# EasyEDA Pro project esp8266开关.eprj, board 2.0
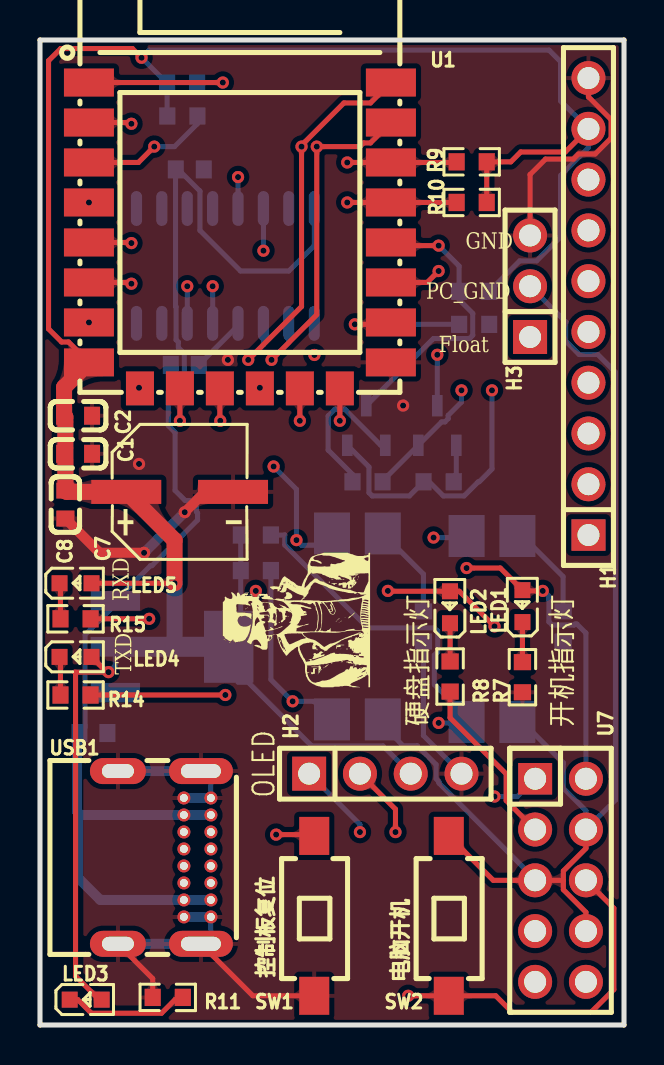
[diagram p2: board, top side]
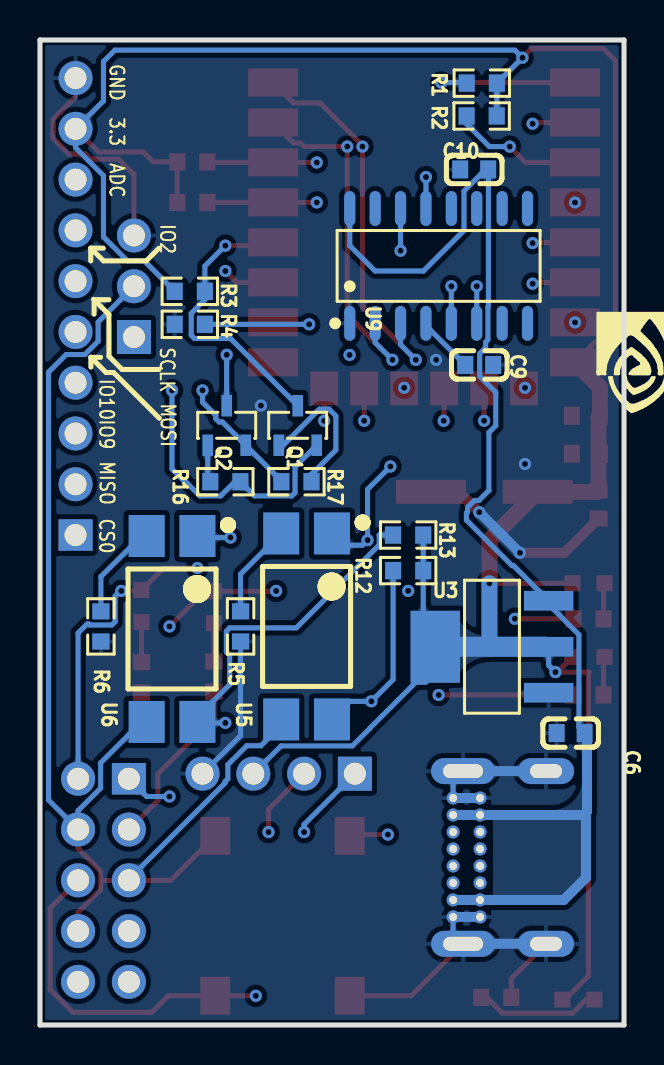
[diagram p3: board, bottom side, seen from below]

Outline 29.21 x 49.28 mm; copper layers: Top Layer, Inner1, Inner2, Bottom Layer. Coordinates in mm from the lower left corner of the outline.
Outline path: 0,49.28 29.21,49.28 29.21,0 0,0 0,49.28
Stack: Top Layer 0.035mm 外层铜厚1oz / Dielectric1 0.2104mm 7628 RC49% 8.6mil / Inner1 0.0152mm 内层铜厚 / Dielectric2 1.065mm 1.1mm H/HOZ Copper / Inner2 0.0152mm 内层铜厚 / Dielectric3 0.2104mm 7628 RC49% 8.6mil / Bottom Layer 0.035mm 外层铜厚1oz

## Design rules (mm)
template: JLCPCB Capability(Two Layers Board)
spacing copperThickness1oz (default): track to track 0.102, other pairs 0.152 to 0.3
spacing copperThickness2oz: track to track 0.203, other pairs 0.152 to 0.3
track width copperThickness1oz (default): min 0.127, default 0.254, max 2.54
track width copperThickness2oz: min 0.203, default 0.254, max 2.54
differential pair differentialPair (default): width min 0.127, default 0.254, max 2.54; gap min 0.152, default 0.152
via viaSize (default): diameter min 0.5, default 0.61, max 10; hole min 0.3, default 0.305, max 6.3

## Placement (name value [footprint] x y rotation side)
C1  100nF  [C0603]  1.91 28.58 180 top
C2  10uF  [C0603]  1.91 30.48 180 top
C6  100nF  [C0603]  2.67 14.61 180 bottom
C7  220uF  [CAP-SMD_BD6.3-L6.6-W6.6-FD]  6.99 26.67 0 top
C8  100nF  [C0603]  1.27 26.03 90 top
C9  100nF  [C0603]  7.24 33.02 0 bottom
C10  100nF  [C0603]  7.49 42.8 180 bottom
H1  其他  [HDR-TH_10P-P2.54-V-F]  27.43 35.94 90 top
H2  OLED  [HDR-TH_4P-P2.54-V-F]  17.27 12.57 0 top
H3  PZ254V-11-03P  [HDR-TH_3P-P2.54-V-M]  24.51 36.96 90 top
LED1  MHT192WDT-ICE  [LED0603-RD]  24.13 20.95 90 top
LED2  MHT192WDT-ICE  [LED0603-RD]  20.51 20.9 90 top
LED3  MHT192WDT-ICE  [LED0603-RD]  2.29 1.27 0 top
LED4  MHT192WDT-ICE  [LED0603-RD]  1.78 18.42 0 top
LED5  MHT192WDT-ICE  [LED0603-RD]  1.78 22.1 0 top
Q1  S8050  [SOT-23-3_L2.9-W1.3-P1.90-LS2.3-BR]  16.32 29.99 270 bottom
Q2  S8050  [SOT-23-3_L2.9-W1.3-P1.90-LS2.3-BR]  19.87 29.99 270 bottom
R1  10kΩ  [R0603]  7.11 47.12 0 bottom
R2  10kΩ  [R0603]  7.12 45.47 0 bottom
R3  10kΩ  [R0603]  21.72 36.7 0 bottom
R4  10kΩ  [R0603]  21.72 35.05 0 bottom
R5  50Ω  [R0603]  19.18 19.94 90 bottom
R6  50Ω  [R0603]  26.16 19.94 90 bottom
R7  550Ω  [R0603]  24.13 17.4 90 top
R8  550Ω  [R0603]  20.51 17.43 90 top
R9  4.7kΩ  [R0603]  21.59 43.18 0 top
R10  4.7kΩ  [R0603]  21.59 41.15 0 top
R11  550Ω  [R0603]  6.39 1.38 0 top
R12  10kΩ  [R0603]  10.79 22.73 180 bottom
R13  10kΩ  [R0603]  10.79 24.51 180 bottom
R14  550Ω  [R0603]  1.78 16.51 180 top
R15  550Ω  [R0603]  1.78 20.32 180 top
R16  10kΩ  [R0603]  19.94 27.18 0 bottom
R17  10kΩ  [R0603]  16.38 27.18 180 bottom
SW1  TS-1101-C-W  [SW-SMD_L6.0-W3.3-LS8.0]  13.72 5.46 90 top
SW2  TS-1101-C-W  [SW-SMD_L6.0-W3.3-LS8.0]  20.45 5.46 90 top
U1  2.4GHz  [WIFIM-SMD_ESP-12F-ESP8266MOD]  10 39.5 270 top
U3  AMS1117-3.3  [SOT-223-4_L6.5-W3.5-P2.30-LS7.0-BR]  6.6 18.92 180 bottom
U5  PS2501-S  [SMD-4_L5.5-W4.5-P2.54-LS10.0-TL]  15.88 19.94 270 bottom
U6  PS2501-S  [SMD-4_L5.5-W4.5-P2.54-LS10.0-TL]  22.61 19.81 270 bottom
U7  PM254-2-05-Z-8.5  [HDR-TH_10P-P2.54-V-F-R2-C5-S2.54]  26.03 7.24 270 top
U9  CH340C  [SOP-16_L10.0-W3.9-P1.27-LS6.0-BL]  9.27 37.97 180 bottom
USB1  TYPEC-306DDW-ARP16  [USB-C-TH_TYPEC-306DDW-ARP16]  6.22 8.38 270 top

## Footprints (pads in the part's own frame, mm; a bottom-side part is the same pattern mirrored in y, then rotated)
C0603
  rect 0.8x0.9 smd: 1(-0.7,0) 2(0.7,0)
CAP-SMD_BD6.3-L6.6-W6.6-FD
  rect 3.5x1.2 smd: 1(-2.67,0) 2(2.67,0)
HDR-TH_3P-P2.54-V-M
  rect 1.7x1.7 hole 1.1: 1(-2.54,0)
  round 1.7 hole 1.1: 2(0,0) 3(2.54,0)
HDR-TH_4P-P2.54-V-F
  rect 1.7x1.7 hole 1.1: 1(-3.81,0)
  round 1.7 hole 1.1: 2(-1.27,0) 3(1.27,0) 4(3.81,0)
HDR-TH_10P-P2.54-V-F
  rect 1.575x1.7 hole 1.1: 1(-11.43,0)
  round 1.7 hole 1.1: 2(-8.89,0) 3(-6.35,0) 4(-3.81,0) 5(-1.27,0) 6(1.27,0) 7(3.81,0) 8(6.35,0) 9(8.89,0) 10(11.43,0)
HDR-TH_10P-P2.54-V-F-R2-C5-S2.54
  rect 1.575x1.7 hole 1.1: 1(-5.08,-1.27)
  round 1.7 hole 1.1: 2(-5.08,1.27) 3(-2.54,-1.27) 4(-2.54,1.27) 5(0,-1.27) 6(0,1.27) 7(2.54,-1.27) 8(2.54,1.27) 9(5.08,-1.27) 10(5.08,1.27)
LED0603-RD
  rect 0.8x0.8 smd: 1(-0.799,0) 2(0.799,0)
R0603
  rect 0.806x0.864 smd: 1(-0.753,0) 2(0.753,0)
SMD-4_L5.5-W4.5-P2.54-LS10.0-TL
  rect 2.1x1.8 smd: 1(-4.65,1.27) 2(-4.65,-1.27) 3(4.65,-1.27) 4(4.65,1.27)
SOP-16_L10.0-W3.9-P1.27-LS6.0-BL
  oval 0.56x1.745 smd: 1(-4.445,-2.873) 2(-3.175,-2.873) 3(-1.905,-2.873) 4(-0.635,-2.873) 5(0.635,-2.873) 6(1.905,-2.873) 7(3.175,-2.873) 8(4.445,-2.873) 9(4.445,2.873) 10(3.175,2.873) 11(1.905,2.873) 12(0.635,2.873) 13(-0.635,2.873) 14(-1.905,2.873) 15(-3.175,2.873) 16(-4.445,2.873)
SOT-23-3_L2.9-W1.3-P1.90-LS2.3-BR
  rect 1.07x0.532 smd: 1(0.99,-0.95) 2(0.99,0.95) 3(-0.99,0)
SOT-223-4_L6.5-W3.5-P2.30-LS7.0-BR
  rect 2.47x0.98 smd: 1(2.835,-2.3) 2(2.835,0) 3(2.835,2.3)
  rect 2.47x3.6 smd: 4(-2.835,0)
SW-SMD_L6.0-W3.3-LS8.0
  rect 1.9x1.5 smd: 1(-4,0) 2(4,0)
USB-C-TH_TYPEC-306DDW-ARP16
  oval 1.3x3.2 hole 0.7x2: 17(4.32,1.825) 20(-4.32,1.825)
  oval 1.3x2.8 hole 0.7x1.6: 18(4.32,-2.325) 19(-4.32,-2.325)
  round 0.65 hole 0.4: A1(-2.975,2.325) A4(-2.125,2.325) A5(-1.275,2.325) A6(-0.425,2.325) A7(0.425,2.325) A8(1.275,2.325) A9(2.125,2.325) A12(2.975,2.325) B1(2.975,0.975) B4(2.125,0.975) B5(1.275,0.975) B6(0.425,0.975) B7(-0.425,0.975) B8(-1.275,0.975) B9(-2.125,0.975) B12(-2.975,0.975)
WIFIM-SMD_ESP-12F-ESP8266MOD
  rect 1.4x2.5 smd: 1(-7.651,-7.551) 2(-5.651,-7.551) 3(-3.651,-7.551) 4(-1.651,-7.551) 5(0.349,-7.551) 6(2.349,-7.551) 7(4.349,-7.551) 8(6.349,-7.551) 9(6.349,7.548) 10(4.349,7.55) 11(2.349,7.551) 12(0.349,7.551) 13(-1.651,7.55) 14(-3.651,7.551) 15(-5.651,7.551) 16(-7.651,7.551)
  rect 1.7x1.4 smd: 17(7.651,-5) 18(7.649,-3.002) 19(7.649,-1.004) 20(7.649,0.998) 21(7.649,2.997) 22(7.651,4.997)

## Nets
As in the schematic.

Pads without a net: H3 1; U7 9 10; U9 7 8 9 10 11 12 15; USB1 A5 A8 B5 B8

## Via types
v1: diameter 0.61, hole 0.305, Top Layer to Bottom Layer, 55 vias

## Routing (per net, layer and track width the routed paths; a pad name or vN(x,y) marks a point on that pad's centre or on a via; arc(x,y) is an arc through that point)
+3.3V: length 134.6
  Top Layer w0.254: 3.34,17.65 1.74,17.65 1.78,17.62 1.78,2.45 3.09,1.14 ; 3.34,17.65 v1(3.43,17.65) ; 3.34,17.65 LED4.2 ; H1.9 26.28,43.67 24.04,43.67 23.55,43.18 R9.2 R10.2 ; v1(5.08,48.39) 4.62,48.85 1.04,48.85 0.43,48.24 0.43,34.82 1.08,34.17 1.43,34.17 U1.8 ; LED5.2 v1(6.73,22.1)
  Top Layer w0.8: v1(6.73,22.1) 6.73,24.25 C7.1 1.34,26.67 C8.2 1.27,30.42 C2.2 1.21,31.9 U1.8
  Bottom Layer w0.254: R2.1 6.36,45.48 R1.1 6.35,47.12 v1(5.08,48.39) 5.46,48.77 25.46,48.77 26.03,48.2 26.03,46.23 H1.9 27.43,43.89 26.03,42.49 26.03,39.42 24.84,38.23 23.99,38.23 R3.2 ; 9.91,17.14 10.41,17.14 12.7,14.86 12.7,14.85 13.59,13.96 17.16,13.96 H2.3 ; v1(3.43,17.65) 3.77,17.99 U3.2 ; R13.2 R12.2 10.04,19.53 U3.4
  Bottom Layer w0.8: v1(6.73,22.1) 6.73,18.99 6.67,18.92
  Bottom Layer w1: U3.4 3.9,18.92
GND: length 54.1
  Top Layer w0.254: USB1.17 10.65,1.46 SW1.1 ; 18.16,33.15 U1.9 ; 5.64,1.13 5.64,2.32 USB1.18 ; H3.3 24.51,42.55 25.28,43.32 26.68,43.32 26.94,43.57 27.77,43.57 28.56,44.36 28.56,45.3 27.43,46.43 H1.10
  Top Layer w0.5: v1(5.21,23.62) 2.98,23.62 C8.1 ; v1(7.24,25.65) 8.25,26.67 C7.2
  Bottom Layer w0.254: USB1.A12 8.55,4.56 USB1.17 ; USB1.20 8.55,12.2 USB1.A1 ; R5.1 19.18,14.48 H2.4
  Bottom Layer w0.5: USB1.19 USB1.20 ; v1(5.21,23.62) v1(7.24,25.65) ; USB1.17 USB1.18 ; USB1.B12 USB1.A1 ; USB1.A12 7.32,5.41
  vias: v1(4.95,28.07) v1(9.4,33.27) v1(18.16,30.99)
VCC: length 65.6
  Bottom Layer w0.254: U9.16 13.72,38.99 12.45,37.72 10.03,37.72 8,39.75 8,41.72 6.78,42.94 6.78,35.95 6.81,35.92 6.81,34.28 6.92,34.16 6.92,33.88 7.22,33.59 7.22,32.45 6.41,31.65 6.41,29.98 6.76,29.64 6.76,26.74 7.26,26.24 7.48,26.24 7.82,25.9 7.82,25.67 7.88,25.61 7.88,25.26 5.6,22.98 5.53,22.98 U3.3 3.77,21.04 2.25,19.53 2.25,14.89 C6.2
  Bottom Layer w0.5: 1.91,10.51 1.91,7.37 3.01,6.26 7.07,6.26 ; USB1.A4 USB1.B9 2.03,10.51 1.85,10.69 1.85,14.49 C6.2 ; USB1.A9 USB1.B4
ADC: length 26.2
  Top Layer w0.254: U1.2 4.51,45.15 v1(4.57,45.08)
  Inner1 w0.254: H1.8 26.03,43.69 23.75,43.69 22.91,44.53 5.13,44.53 v1(4.57,45.08)
CS0: length 26.5
  Inner1 w0.254: v1(4.95,31.88) 4.95,30.3 8.05,27.2 23.6,27.2 26.29,24.51 H1.1
D+: length 33.1
  Inner2 w0.254: 7.2,7.96 7.7,7.96 7.94,8.2 7.94,8.21 8.3,8.56 8.3,8.56 USB1.A6 8.79,9.05 8.8,9.05 10.03,10.29 10.03,13.33 8.43,14.94 8.43,30.47 8.64,30.67 v1(8.64,36.96)
  Bottom Layer w0.254: U9.5 v1(8.64,36.96)
D-: length 33.1
  Inner1 w0.254: USB1.B7 7.7,8.81 7.94,8.56 7.94,8.56 8.3,8.2 8.3,8.2 8.55,7.96
  Inner2 w0.254: USB1.B7 6.95,9.05 6.95,9.05 6.17,9.83 6.17,15.06 7.87,16.76 7.87,30.3 7.49,30.68 7.49,36.83 v1(7.37,36.96)
  Bottom Layer w0.254: U9.6 v1(7.37,36.96)
DTR: length 32.8
  Inner1 w0.254: v1(22.61,31.75) 21.41,32.94 19.63,32.94 10.16,42.42 v1(9.91,42.42)
  Bottom Layer w0.254: v1(9.91,42.42) U9.13 ; Q1.2 16.45,27.92 16.45,26.63 16.62,26.47 18.47,26.47 R16.1 19.46,27.18 20.17,26.47 21.21,26.47 21.92,27.18 21.97,27.18 22.61,27.81 v1(22.61,31.75)
EN: length 27.6
  Top Layer w0.254: U1.3 4.92,43.15 v1(5.72,43.94)
  Inner1 w0.254: v1(5.72,43.94) 9.46,43.94 v1(19.87,33.53)
  Bottom Layer w0.254: Q2.3 v1(19.87,33.53) ; v1(5.72,43.94) 6.73,43.94 7.87,45.08 R2.2
ESP_RST: length 49
  Top Layer w0.254: U1.1 v1(9.14,47.15) ; SW1.2 13.65,9.53 v1(11.81,9.53)
  Inner2 w0.254: v1(11.81,9.53) 11.81,27.24 12.27,27.7 12.27,44.02 v1(9.14,47.15)
  Bottom Layer w0.254: R1.2 7.9,47.15 v1(9.14,47.15)
ESP_RXD: length 38.7
  Top Layer w0.254: U1.15 16.53,44.13 16.19,44.13 16,43.94 v1(13.84,43.94) 13.84,35.54 v1(11.58,33.27) ; R15.1 v1(5.46,20.32)
  Inner1 w0.254: v1(5.46,20.32) 9.4,20.32 v1(10.79,21.72)
  Inner2 w0.254: v1(10.79,21.72) 11.1,22.02 11.1,28.18 11.58,28.66 v1(11.58,33.27)
  Bottom Layer w0.254: v1(11.58,33.27) 12.45,34.14 U9.2
ESP_TXD: length 43.7
  Top Layer w0.254: v1(10.41,33.27) 13.08,35.94 v1(13.08,43.94) 13.08,44.01 15.2,46.13 16.53,46.13 U1.16 ; v1(9.27,16.51) R14.1
  Inner2 w0.254: v1(10.41,33.27) 10.21,33.07 10.21,17.45 v1(9.27,16.51)
  Bottom Layer w0.254: v1(10.41,33.27) 11.18,34.04 U9.3
HDD_LED+: length 45.3
  Top Layer w0.254: v1(22.73,19.94) 20.97,21.7 LED2.2 17.42,21.7 v1(17.4,21.72) ; U1.5 4.54,39.15 v1(4.57,39.12)
  Inner1 w0.254: v1(4.57,39.12) 4.57,37.91 3.99,37.33 3.99,29.99 10.74,23.24 10.79,23.24 12.32,21.72 v1(17.4,21.72) ; v1(22.73,11.43) v1(22.73,19.94)
  Bottom Layer w0.254: U7.1 23.88,11.43 v1(22.73,11.43)
HDD_LED-: length 8.7
  Top Layer w0.254: R8.1 20.51,15.37 23.32,12.56 23.32,11.23 U7.3
IO0: length 14.4
  Top Layer w0.254: v1(19.94,38.99) 17.71,38.99 U1.12
  Bottom Layer w0.254: v1(19.94,38.99) 20.96,37.96 R3.1 20.96,36.28 21.65,35.6 21.65,34.5 21.48,34.34 19.68,34.34 Q1.3
IO2: length 11
  Top Layer w0.254: v1(19.94,37.72) 19.37,37.15 U1.11
  Inner1 w0.254: H1.7 26.54,39.75 24.88,38.09 24.04,38.09 23.68,37.72 v1(19.94,37.72)
IO9: length 21.4
  Top Layer w0.254: U1.19 9,30.25 v1(9.02,30.23)
  Inner1 w0.254: H1.3 26.8,30.23 26.03,30.23 24.73,28.93 11.47,28.93 10.17,30.23 v1(9.02,30.23)
IO10: length 19
  Inner1 w0.254: H1.4 25.53,30.23 23.49,30.23 22.55,29.29 13.11,29.29 11,31.4 v1(11,31.88)
MISO: length 26.3
  Top Layer w0.254: U1.18 v1(7,30.23)
  Inner1 w0.254: v1(7,30.23) 8.19,30.23 9.84,28.57 16.09,28.57 16.27,28.39 16.27,27.81 16.45,27.63 17.62,27.63 17.79,27.81 17.79,28.39 17.97,28.57 19.14,28.57 19.32,28.39 19.32,27.81 19.5,27.63 20.66,27.63 20.84,27.81 20.84,28.39 21.02,28.57 25.91,28.57 H1.2
MOSI: length 18.4
  Top Layer w0.254: U1.21 v1(13,30.23)
  Inner1 w0.254: H1.5 22.99,30.23 22.92,30.23 22.33,29.64 14.75,29.64 14.17,30.23 v1(13,30.23)
P_LED+: length 46
  Top Layer w0.254: v1(25.15,21.72) 24.17,21.72 LED1.2 23.02,22.86 v1(21.34,22.86)
  Inner1 w0.254: v1(13.72,33.52) 6.1,41.15 v1(2.45,41.15)
  Inner2 w0.254: v1(21.34,22.86) 17.27,22.86 15.58,24.55 15.58,30.47 13.82,32.23 13.82,33.43 v1(13.72,33.52)
  Bottom Layer w0.254: v1(25.15,21.72) 25.2,21.72 25.45,21.46 25.45,20.17 25.61,20.01 26.71,20.01 26.76,20.06 26.85,20.06 27.31,19.61 U7.2
PC_GND: length 61.1
  Top Layer w0.254: 26.18,7.24 U7.5 22.67,7.24 SW2.2 ; U7.4 27.31,8.84 26.18,7.71 26.18,6.77 27.31,5.64 U7.8
  Bottom Layer w0.254: 24.13,15.16 26.18,13.12 26.18,11.85 27.31,10.72 U7.4 28.78,11.26 28.78,32.66 27.9,33.54 26.96,33.54 26.3,34.2 26.3,35.17 H3.2 ; U7.5 24.76,7.29 19.95,12.11 19.95,12.18 19.81,12.32 19.81,13.03 18.87,13.97 18.16,13.97 17.27,14.86 17.27,15.16 U5.3
PC_PWR: length 22.6
  Top Layer w0.254: v1(4.57,37.08) 4.51,37.15 U1.6
  Inner1 w0.254: v1(4.57,37.08) 5.97,35.69 5.97,30.35 8.38,27.94 v1(11.68,27.94)
  Bottom Layer w0.254: v1(11.68,27.94) 12.83,26.8 v1(12.83,24.26) 13.08,24 14.27,24 14.6,24.33 U5.1
PC_RST: length 30.3
  Inner1 w0.254: v1(19.69,24.38) 19.69,23.66 17.98,21.96 17.98,21.47 17.64,21.13 17.45,21.13 17.37,21.06 12.47,21.06 10.65,22.89 9.18,22.89 3.63,28.44 3.63,33.96 v1(2.45,35.15)
  Bottom Layer w0.254: 21.59,24.46 21.51,24.38 v1(19.69,24.38)
POWER_SW+: length 45.4
  Top Layer w0.254: U7.6 28.7,5.84 28.7,1.78 27.56,0.63 23.62,0.63 22.8,1.46 SW2.1 v1(18.41,1.46)
  Inner1 w0.254: v1(12.64,16.19) 10.41,13.97 10.41,9.46 v1(18.41,1.46)
  Bottom Layer w0.254: U5.4 13.7,16.19 v1(12.64,16.19) 11.55,17.28 R12.1
RST_SW+: length 30.1
  Inner1 w0.254: v1(19.94,15.11) 19.94,9.53 U7.7
  Bottom Layer w0.254: R13.1 12.24,24.51 12.24,24.51 12.24,24.02 16.39,19.87 19.72,19.87 19.89,19.7 19.89,18.67 19.72,18.5 19.72,17.03 21.59,15.16 21.54,15.11 v1(19.94,15.11)
RTS: length 21.2
  Inner1 w0.254: v1(21.08,31.75) 20.24,32.59 19.48,32.59 13.34,38.73 v1(11.18,38.73)
  Bottom Layer w0.254: v1(11.18,38.73) U9.14 ; v1(21.08,31.75) 21.08,31.16 20.42,30.5 20.42,30.33 20.25,30.17 20.09,30.17 Q2.2 17.14,27.22 R17.1
SCL: length 44.9
  Top Layer w0.254: R10.1 U1.13 v1(15.37,41.15) ; H2.2 17.78,10.8 v1(17.78,9.65)
  Inner2 w0.254: v1(15.37,41.15) 15.16,40.94 15.16,32.2 23.57,23.8 23.57,22.49 15.37,14.29 15.37,13.21 H2.2
SCLK: length 24.4
  Top Layer w0.254: U1.22 v1(15,30.23)
  Inner1 w0.254: v1(15,30.23) 15.66,30.23 15.84,30.41 15.84,31.82 16.02,32 17.18,32 17.36,31.82 17.36,30.41 17.54,30.23 18.71,30.23 18.89,30.41 18.89,31.82 19.07,32 20.23,32 20.41,31.82 20.41,30.41 20.59,30.23 22.41,30.23 25.64,33.45 25.64,35.42 H1.6
SDA: length 41.7
  Top Layer w0.254: R9.1 20.8,43.15 U1.14 v1(15.37,43.15)
  Inner2 w0.254: H2.1 13.58,12.69 13.58,30.47 13.46,30.59 13.46,32.9 13.42,32.94 13.1,32.94 12.76,33.28 12.76,40.54 v1(15.37,43.15)
  Bottom Layer w0.254: H2.1 16,10.03 v1(16,9.65)
$1N2533: length 7.1
  Top Layer w0.254: v1(15.75,35.05) 17.45,35.05 U1.10
  Bottom Layer w0.254: R4.1 v1(15.75,35.05)
$1N2537: length 4.7
  Bottom Layer w0.254: R5.2 19.18,22.56 U5.2
$1N2541: length 4.6
  Bottom Layer w0.254: 24.13,24.46 26.16,22.43 R6.2
$1N2565: length 2
  Top Layer w0.254: R7.2 LED1.1
$1N2573: length 1.9
  Top Layer w0.254: R8.2 20.51,20.09 LED2.1
$1N2635: length 6.3
  Top Layer w0.254: R11.2 7.03,1.27 6.75,1.27 6.08,0.59 2.57,0.59 1.89,1.27 LED3.1
$1N2653: length 1.9
  Top Layer w0.254: LED4.1 1.02,18.37 R14.2
$1N2655: length 1.8
  Top Layer w0.254: LED5.1 1.02,22.05 R15.2
$1N3077: length 2.9
  Bottom Layer w0.254: C9.2 9.91,34.99 U9.4
$1N3432: length 7.5
  Bottom Layer w0.254: Q1.1 17.05,29 15.24,30.81 14.75,30.81 14.41,30.47 14.41,28.76 15.63,27.55 R17.2
$1N3436: length 1.9
  Bottom Layer w0.254: R16.2 20.82,27.31 Q2.1

## Copper pours and planes (outline as drawn; the poured copper is in the pictures)
GND on Top Layer: 0,49.28 29.21,49.28 29.21,0 0,0
GND on Bottom Layer: 0,49.28 29.21,49.28 29.21,0 0,0
GND on Inner2: 0,49.28 29.21,49.28 29.21,0 0,0
VCC on Bottom Layer: 2.03,10.51 6.57,10.51 6.57,6.26 3.01,6.26 1.91,7.37 1.91,10.38
VCC on Bottom Layer: 1.91,10.51 6.56,10.51 6.56,6.26 1.91,6.26
D+ on Bottom Layer: 2.13,10.51 6.45,10.51 6.45,6.26 3.05,6.26 2.03,7.27 2.03,10.6

Small or netless copper shapes (teardrops, artwork), in the pictures only: 108 on Top Layer, 97 on Bottom Layer, 31 on Inner1, 11 on Inner2

## Text on the board
Bottom Silkscreen Layer: MOSI | IO2 | SCLK | GND | 3.3 | ADC | MISO | IO10 | IO9 | CS0
Top Silkscreen Layer: OLED | PC_GND | Float | GND | RXD | TXD | 控制板复位 | 电脑开机 | 硬盘指示灯 | 开机指示灯
